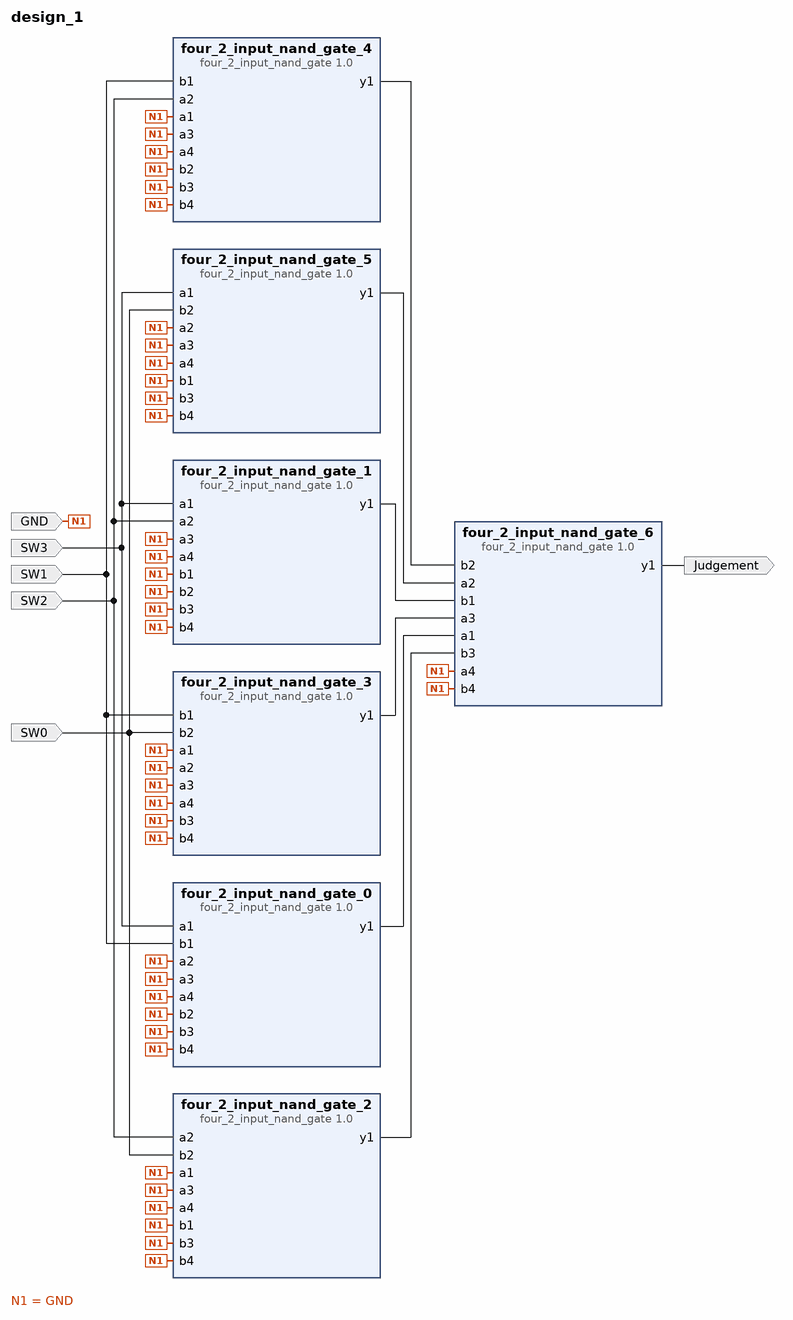
[diagram p0: block diagram of the top level]
# Vivado block design design_1, Vivado 2014.2
create_bd_design design_1

create_bd_port -dir I -type data SW3
create_bd_port -dir I -type data SW2
create_bd_port -dir I -type data SW1
create_bd_port -dir I -type data SW0
create_bd_port -dir I -type data GND
create_bd_port -dir O -type data Judgement

create_bd_cell -type ip -vlnv xilinx.com:XUP:four_2_input_nand_gate:1.0 four_2_input_nand_gate_0
create_bd_cell -type ip -vlnv xilinx.com:XUP:four_2_input_nand_gate:1.0 four_2_input_nand_gate_1
create_bd_cell -type ip -vlnv xilinx.com:XUP:four_2_input_nand_gate:1.0 four_2_input_nand_gate_2
create_bd_cell -type ip -vlnv xilinx.com:XUP:four_2_input_nand_gate:1.0 four_2_input_nand_gate_3
create_bd_cell -type ip -vlnv xilinx.com:XUP:four_2_input_nand_gate:1.0 four_2_input_nand_gate_4
create_bd_cell -type ip -vlnv xilinx.com:XUP:four_2_input_nand_gate:1.0 four_2_input_nand_gate_5
create_bd_cell -type ip -vlnv xilinx.com:XUP:four_2_input_nand_gate:1.0 four_2_input_nand_gate_6

# ---- connections ----

connect_bd_net -net SW3_1 [get_bd_ports SW3] \
  [get_bd_pins four_2_input_nand_gate_0/a1] [get_bd_pins four_2_input_nand_gate_1/a1] \
  [get_bd_pins four_2_input_nand_gate_5/a1]
connect_bd_net -net SW1_1 [get_bd_ports SW1] \
  [get_bd_pins four_2_input_nand_gate_0/b1] [get_bd_pins four_2_input_nand_gate_4/b1] \
  [get_bd_pins four_2_input_nand_gate_3/b1]
connect_bd_net -net SW2_1 [get_bd_ports SW2] \
  [get_bd_pins four_2_input_nand_gate_1/a2] [get_bd_pins four_2_input_nand_gate_4/a2] \
  [get_bd_pins four_2_input_nand_gate_2/a2]
connect_bd_net -net SW0_1 [get_bd_ports SW0] \
  [get_bd_pins four_2_input_nand_gate_5/b2] [get_bd_pins four_2_input_nand_gate_3/b2] \
  [get_bd_pins four_2_input_nand_gate_2/b2]
connect_bd_net [get_bd_ports GND] \
  [get_bd_pins four_2_input_nand_gate_0/a2] [get_bd_pins four_2_input_nand_gate_0/b2] \
  [get_bd_pins four_2_input_nand_gate_0/a3] [get_bd_pins four_2_input_nand_gate_0/b3] \
  [get_bd_pins four_2_input_nand_gate_0/a4] [get_bd_pins four_2_input_nand_gate_0/b4] \
  [get_bd_pins four_2_input_nand_gate_1/b1] [get_bd_pins four_2_input_nand_gate_1/b2] \
  [get_bd_pins four_2_input_nand_gate_1/a3] [get_bd_pins four_2_input_nand_gate_1/b3] \
  [get_bd_pins four_2_input_nand_gate_1/a4] [get_bd_pins four_2_input_nand_gate_1/b4] \
  [get_bd_pins four_2_input_nand_gate_5/b1] [get_bd_pins four_2_input_nand_gate_5/a2] \
  [get_bd_pins four_2_input_nand_gate_5/a3] [get_bd_pins four_2_input_nand_gate_5/b3] \
  [get_bd_pins four_2_input_nand_gate_5/a4] [get_bd_pins four_2_input_nand_gate_5/b4] \
  [get_bd_pins four_2_input_nand_gate_4/a1] [get_bd_pins four_2_input_nand_gate_4/b2] \
  [get_bd_pins four_2_input_nand_gate_4/a3] [get_bd_pins four_2_input_nand_gate_4/b3] \
  [get_bd_pins four_2_input_nand_gate_4/a4] [get_bd_pins four_2_input_nand_gate_4/b4] \
  [get_bd_pins four_2_input_nand_gate_3/a1] [get_bd_pins four_2_input_nand_gate_3/a2] \
  [get_bd_pins four_2_input_nand_gate_3/a3] [get_bd_pins four_2_input_nand_gate_3/b3] \
  [get_bd_pins four_2_input_nand_gate_3/a4] [get_bd_pins four_2_input_nand_gate_3/b4] \
  [get_bd_pins four_2_input_nand_gate_2/a1] [get_bd_pins four_2_input_nand_gate_2/b1] \
  [get_bd_pins four_2_input_nand_gate_2/a3] [get_bd_pins four_2_input_nand_gate_2/b3] \
  [get_bd_pins four_2_input_nand_gate_2/b4] [get_bd_pins four_2_input_nand_gate_2/a4] \
  [get_bd_pins four_2_input_nand_gate_6/a4] [get_bd_pins four_2_input_nand_gate_6/b4]
connect_bd_net [get_bd_pins four_2_input_nand_gate_0/y1] [get_bd_pins four_2_input_nand_gate_6/a1]
connect_bd_net [get_bd_pins four_2_input_nand_gate_1/y1] [get_bd_pins four_2_input_nand_gate_6/b1]
connect_bd_net [get_bd_pins four_2_input_nand_gate_5/y1] [get_bd_pins four_2_input_nand_gate_6/a2]
connect_bd_net [get_bd_pins four_2_input_nand_gate_4/y1] [get_bd_pins four_2_input_nand_gate_6/b2]
connect_bd_net [get_bd_pins four_2_input_nand_gate_3/y1] [get_bd_pins four_2_input_nand_gate_6/a3]
connect_bd_net [get_bd_pins four_2_input_nand_gate_2/y1] [get_bd_pins four_2_input_nand_gate_6/b3]
connect_bd_net [get_bd_pins four_2_input_nand_gate_6/y1] [get_bd_ports Judgement]

validate_bd_design
save_bd_design
